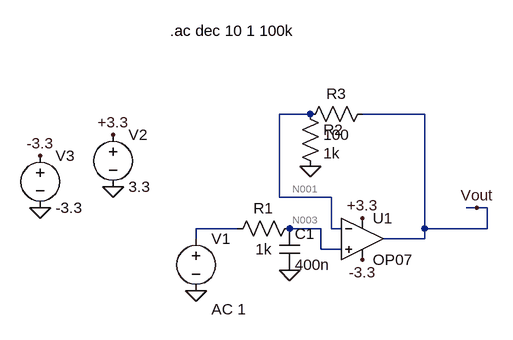
[diagram p0: schematic EMG_LPF_filter_test.asc]
EMG_LPF_filter_test.asc, the LTspice schematic file:
Version 4.1
SHEET 1 880 680
WIRE 112 -32 64 -32
WIRE 288 -32 192 -32
WIRE 64 96 64 -32
WIRE 144 96 64 96
WIRE 368 112 352 112
WIRE 384 112 368 112
WIRE 0 144 -64 144
WIRE 128 144 80 144
WIRE 144 144 144 96
WIRE 160 144 144 144
WIRE 288 144 288 -32
WIRE 384 144 384 112
WIRE 384 144 288 144
WIRE -64 160 -64 144
WIRE 288 160 288 144
WIRE 288 160 224 160
WIRE 128 176 128 144
WIRE 160 176 128 176
FLAG 80 208 0
FLAG -64 240 0
FLAG -304 112 0
FLAG -192 80 0
FLAG -192 0 +3.3
FLAG -304 32 -3.3
FLAG 192 128 +3.3
FLAG 192 192 -3.3
FLAG 112 48 0
FLAG 368 112 Vout
SYMBOL OpAmps\\OP07 192 96 R0
SYMATTR InstName U1
SYMBOL res 96 128 R90
WINDOW 0 0 56 VBottom 2
WINDOW 3 32 56 VTop 2
SYMATTR InstName R1
SYMATTR Value 1k
SYMBOL cap 64 144 R0
SYMATTR InstName C1
SYMATTR Value 400n
SYMBOL voltage -64 144 R0
WINDOW 123 24 124 Left 2
WINDOW 39 0 0 Left 0
SYMATTR Value2 AC 1
SYMATTR InstName V1
SYMATTR Value ""
SYMBOL voltage -192 -16 R0
WINDOW 123 0 0 Left 0
WINDOW 39 0 0 Left 0
SYMATTR InstName V2
SYMATTR Value 3.3
SYMBOL voltage -304 16 R0
WINDOW 123 0 0 Left 0
WINDOW 39 0 0 Left 0
SYMATTR InstName V3
SYMATTR Value -3.3
SYMBOL res 96 -48 R0
SYMATTR InstName R2
SYMATTR Value 1k
SYMBOL res 208 -48 R90
WINDOW 0 0 56 VBottom 2
WINDOW 3 32 56 VTop 2
SYMATTR InstName R3
SYMATTR Value 100
TEXT -104 -160 Left 2 !.ac dec 10 1 100k

The netlist it stands for:
* EMG_LPF_filter_test.asc
X§U1 N003 N001 +3.3 -3.3 Vout LT1001  ; OP07, pins In+ In- V+ V- OUT
R1 N003 N002 1k
C1 N003 0 400n
V1 N002 0 AC 1
V2 +3.3 0 3.3
V3 -3.3 0 -3.3
R2 N001 0 1k
R3 Vout N001 100
.ac dec 10 1 100k
.lib LTC.lib
.backanno
.end

* Results of the author's LTspice run, read from the files saved beside the schematic
* Operating Point, zero values left out:
*   V(-3.3) = -3.3 V
*   V(+3.3) = 3.3 V
*   I(V2) = -2.25 mA
*   I(V3) = 2.25 mA
*   Ix(u1:3) = 2.25 mA
*   Ix(u1:4) = -2.25 mA
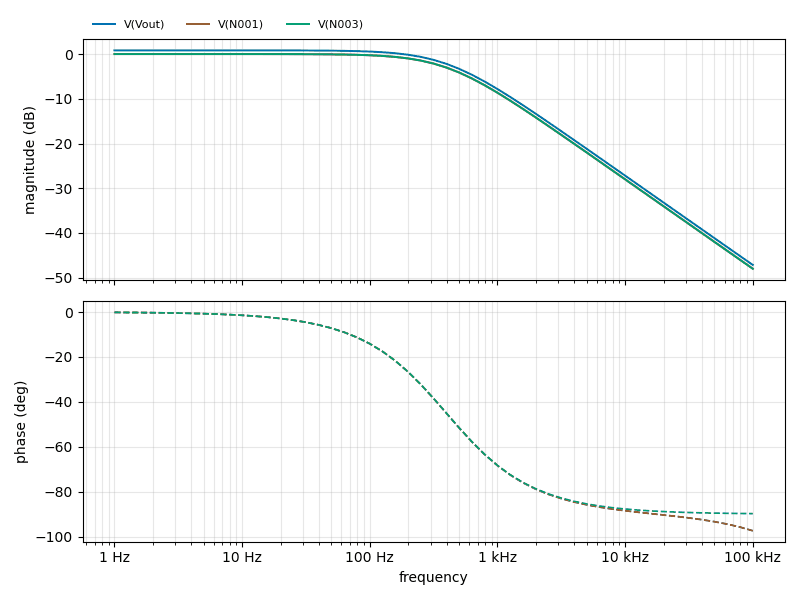
[diagram p1: AC Analysis of EMG_LPF_filter_test.asc, plotted from the saved traces]
* AC Analysis, 1 run:
*   V(Vout): 0.83 dB at 1 Hz, -47.15 dB at 100 kHz, peak 0.83 dB at 1 Hz, 3 dB below the peak at 397.9 Hz
*   V(N001): -0.00 dB at 1 Hz, -47.97 dB at 100 kHz, peak -0.00 dB at 1 Hz, 3 dB below the peak at 397.9 Hz
*   V(N003): -0.00 dB at 1 Hz, -48.00 dB at 100 kHz, peak -0.00 dB at 1 Hz, 3 dB below the peak at 397.9 Hz